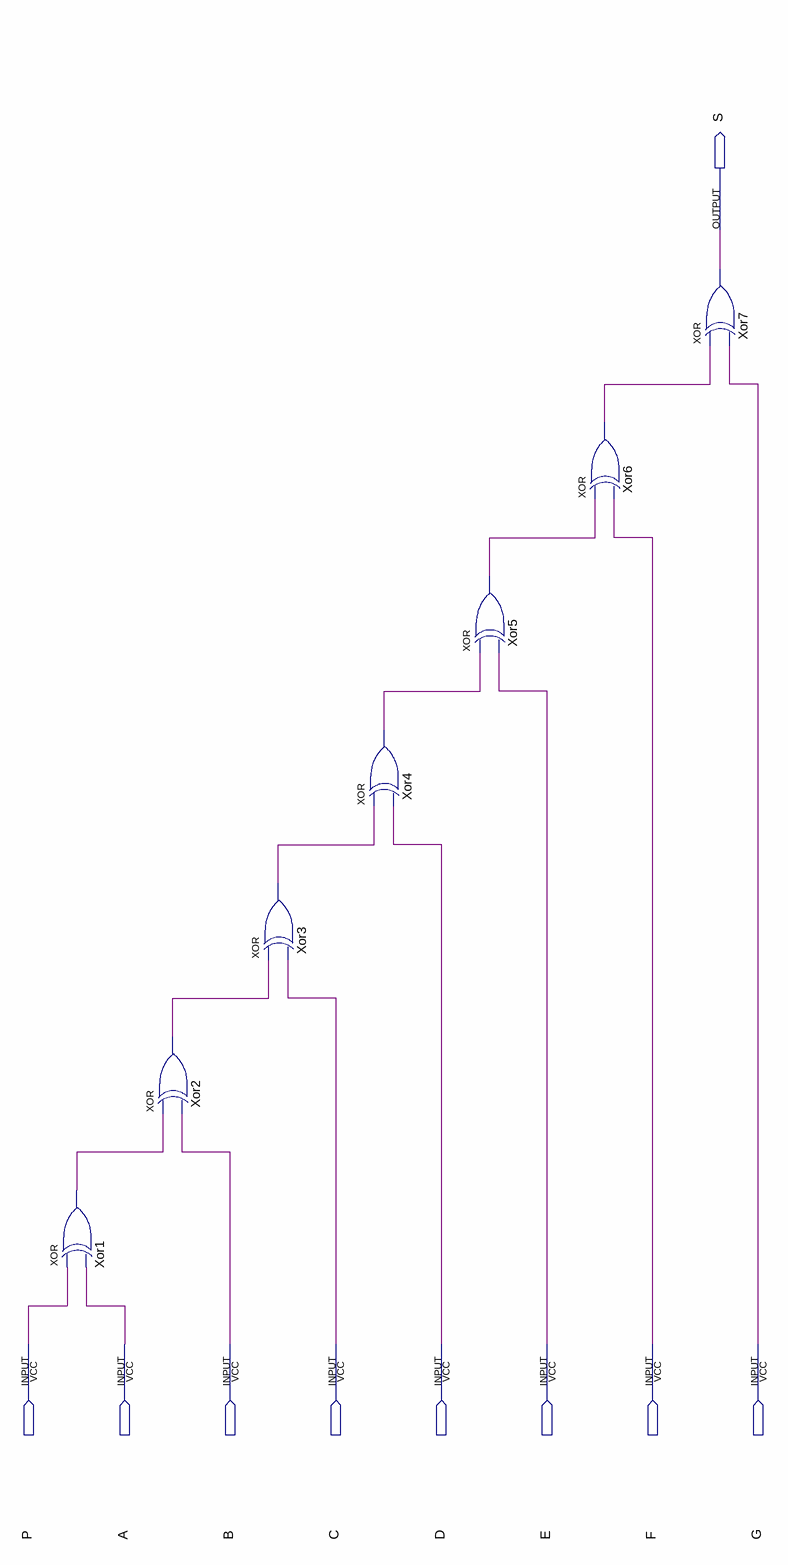
[diagram p0: schematic sheet]
// Quartus schematic Paridade.bdf as structural Verilog: 7 symbols, 9 pins
module Paridade (
  input  P,
  input  A,
  input  B,
  input  C,
  input  D,
  input  E,
  input  F,
  input  G,
  output S
);

  wire Xor1_out, Xor2_out, Xor3_out, Xor4_out, Xor5_out, Xor6_out;

  xor Xor1 (Xor1_out, P, A);
  xor Xor2 (Xor2_out, Xor1_out, B);
  xor Xor3 (Xor3_out, Xor2_out, C);
  xor Xor4 (Xor4_out, Xor3_out, D);
  xor Xor5 (Xor5_out, Xor4_out, E);
  xor Xor6 (Xor6_out, Xor5_out, F);
  xor Xor7 (S, Xor6_out, G);
endmodule
